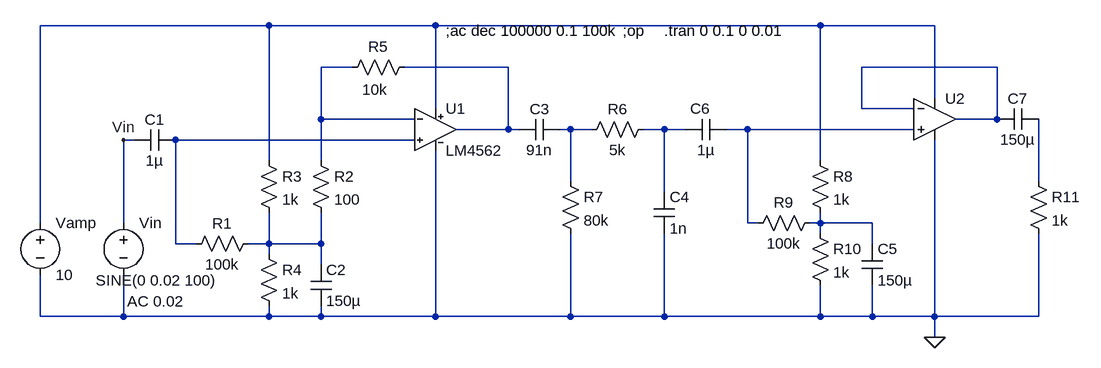
[diagram p0: schematic Normalization_test_bandpass.asc]
Normalization_test_bandpass.asc, the LTspice schematic file:
Version 4
SHEET 1 1384 760
WIRE 32 144 -320 144
WIRE 288 144 32 144
WIRE 880 144 288 144
WIRE 1056 144 880 144
WIRE 160 208 112 208
WIRE 400 208 240 208
WIRE 1152 208 944 208
WIRE 1056 256 1056 144
WIRE 288 272 288 144
WIRE 944 272 944 208
WIRE 1024 272 944 272
WIRE 112 288 112 208
WIRE 256 288 112 288
WIRE 1152 288 1152 208
WIRE 1152 288 1088 288
WIRE 400 304 400 208
WIRE 400 304 320 304
WIRE 416 304 400 304
WIRE 496 304 480 304
WIRE 528 304 496 304
WIRE 640 304 608 304
WIRE 672 304 640 304
WIRE 768 304 736 304
WIRE 1024 304 768 304
WIRE -176 320 -192 320
WIRE 256 320 -112 320
WIRE 32 352 32 144
WIRE 112 352 112 288
WIRE 880 352 880 144
WIRE 496 384 496 304
WIRE 1216 384 1216 288
WIRE 640 400 640 304
WIRE -320 448 -320 144
WIRE -192 448 -192 320
WIRE 768 448 768 304
WIRE 784 448 768 448
WIRE 880 448 880 432
WIRE 880 448 864 448
WIRE 960 448 880 448
WIRE 880 464 880 448
WIRE -112 480 -112 320
WIRE -80 480 -112 480
WIRE 32 480 32 432
WIRE 32 480 0 480
WIRE 112 480 112 432
WIRE 112 480 32 480
WIRE 960 480 960 448
WIRE 32 496 32 480
WIRE 112 512 112 480
WIRE -320 592 -320 528
WIRE -192 592 -192 528
WIRE -192 592 -320 592
WIRE 32 592 32 576
WIRE 32 592 -192 592
WIRE 112 592 112 576
WIRE 112 592 32 592
WIRE 288 592 288 336
WIRE 288 592 112 592
WIRE 496 592 496 464
WIRE 496 592 288 592
WIRE 640 592 640 464
WIRE 640 592 496 592
WIRE 880 592 880 544
WIRE 880 592 640 592
WIRE 960 592 960 544
WIRE 960 592 880 592
WIRE 1056 592 1056 320
WIRE 1056 592 960 592
WIRE 1216 592 1216 464
WIRE 1216 592 1056 592
WIRE 1056 624 1056 592
FLAG -192 320 Vin
FLAG 1056 624 0
SYMBOL NewOpamps\\LM4562 288 240 R0
SYMATTR InstName U1
SYMBOL Overige\ componenten\\voltage -192 432 R0
WINDOW 123 6 137 Left 2
WINDOW 39 0 0 Left 2
WINDOW 3 -43 104 Left 2
SYMATTR Value2 AC 0.02
SYMATTR Value SINE(0 0.02 100)
SYMATTR InstName Vin
SYMBOL res -96 496 R270
WINDOW 0 32 56 VTop 2
WINDOW 3 0 56 VBottom 2
SYMATTR InstName R1
SYMATTR Value 100k
SYMBOL cap -176 336 R270
WINDOW 0 32 32 VTop 2
WINDOW 3 0 32 VBottom 2
SYMATTR InstName C1
SYMATTR Value 1µ
SYMBOL res 16 336 R0
SYMATTR InstName R3
SYMATTR Value 1k
SYMBOL cap 96 512 R0
SYMATTR InstName C2
SYMATTR Value 150µ
SYMBOL Overige\ componenten\\voltage -320 432 R0
WINDOW 123 0 0 Left 2
WINDOW 39 0 0 Left 2
SYMATTR InstName Vamp
SYMATTR Value 10
SYMBOL res 96 336 R0
SYMATTR InstName R2
SYMATTR Value 100
SYMBOL res 144 224 R270
WINDOW 0 32 56 VTop 2
WINDOW 3 -3 51 VBottom 2
SYMATTR InstName R5
SYMATTR Value 10k
SYMBOL res 16 480 R0
SYMATTR InstName R4
SYMATTR Value 1k
SYMBOL cap 416 320 R270
WINDOW 0 32 32 VTop 2
WINDOW 3 0 32 VBottom 2
SYMATTR InstName C3
SYMATTR Value 91n
SYMATTR SpiceLine Rser=0.1
SYMBOL res 480 368 R0
SYMATTR InstName R7
SYMATTR Value 80k
SYMBOL res 512 320 R270
WINDOW 0 32 56 VTop 2
WINDOW 3 0 56 VBottom 2
SYMATTR InstName R6
SYMATTR Value 5k
SYMBOL cap 624 400 R0
SYMATTR InstName C4
SYMATTR Value 1n
SYMATTR SpiceLine Rser=0.1
SYMBOL res 864 336 R0
SYMATTR InstName R8
SYMATTR Value 1k
SYMBOL cap 944 480 R0
SYMATTR InstName C5
SYMATTR Value 150µ
SYMATTR SpiceLine Rser=0.1
SYMBOL res 864 448 R0
SYMATTR InstName R10
SYMATTR Value 1k
SYMBOL cap 672 320 R270
WINDOW 0 33 23 VTop 2
WINDOW 3 0 32 VBottom 2
SYMATTR InstName C6
SYMATTR Value 1µ
SYMATTR SpiceLine Rser=0.1
SYMBOL res 768 464 R270
WINDOW 0 32 56 VTop 2
WINDOW 3 0 56 VBottom 2
SYMATTR InstName R9
SYMATTR Value 100k
SYMBOL Opamps\\UniversalOpamp2 1056 288 R0
SYMATTR InstName U2
SYMBOL cap 1152 304 R270
WINDOW 0 32 32 VTop 2
WINDOW 3 0 32 VBottom 2
SYMATTR InstName C7
SYMATTR Value 150µ
SYMBOL res 1200 368 R0
SYMATTR InstName R11
SYMATTR Value 1k
TEXT 576 152 Left 2 !;op
TEXT 640 152 Left 2 !.tran 0 0.1 0 0.01
TEXT 304 152 Left 2 !;ac dec 100000 0.1 100k

The netlist it stands for:
* Normalization_test_bandpass.asc
XU1 N008 N002 N001 0 N003 LM4562  ; pins In+ In- V+ V- OUT
Vin Vin 0 SINE(0 0.02 100) AC 0.02
R1 N008 N011 100k
C1 Vin N008 1µ
R3 N001 N011 1k
C2 N011 0 150µ
Vamp N001 0 10
R2 N002 N011 100
R5 N002 N003 10k
R4 N011 0 1k
C3 N003 N005 91n Rser=0.1
R7 N005 0 80k
R6 N005 N006 5k
C4 N006 0 1n Rser=0.1
R8 N001 N010 1k
C5 N010 0 150µ Rser=0.1
R10 N010 0 1k
C6 N006 N007 1µ Rser=0.1
R9 N007 N010 100k
XU2 N007 N004 N001 0 N004 level.2 Avol=1Meg GBW=10Meg Slew=10Meg ilimit=25m rail=0 Vos=0 phimargin=45 en=0 enk=0 in=0 ink=0 Rin=500Meg  ; pins IN+ IN- V+ V- OUT
C7 N004 N009 150µ
R11 N009 0 1k
;op
.tran 0 0.1 0 0.01
;ac dec 100000 0.1 100k
.lib NewOpamps\LM4562.lib
.lib UniversalOpamps2.sub
.backanno
.end